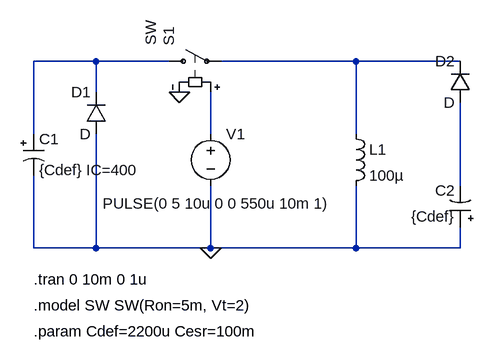
[diagram p0: schematic Coilgun-1V03.asc]
Coilgun-1V03.asc, the LTspice schematic file:
Version 4
SHEET 1 880 680
WIRE -672 -144 -768 -144
WIRE -560 -144 -672 -144
WIRE -272 -144 -480 -144
WIRE -112 -144 -272 -144
WIRE -672 -96 -672 -144
WIRE -768 -32 -768 -144
WIRE -496 -32 -496 -96
WIRE -272 -32 -272 -144
WIRE -112 48 -112 -80
WIRE -768 144 -768 32
WIRE -672 144 -672 -32
WIRE -672 144 -768 144
WIRE -496 144 -496 48
WIRE -496 144 -672 144
WIRE -272 144 -272 48
WIRE -272 144 -496 144
WIRE -112 144 -112 112
WIRE -112 144 -272 144
FLAG -496 144 0
FLAG -544 -96 0
SYMBOL polcap -784 -32 R0
WINDOW 3 24 56 Left 2
SYMATTR Value {Cdef} IC=400
SYMATTR InstName C1
SYMATTR SpiceLine V=63 Irms=900m Rser={Cesr} Lser=0
SYMATTR Description Capacitor
SYMATTR Type cap
SYMBOL ind -288 -48 R0
SYMATTR InstName L1
SYMATTR Value 100µ
SYMATTR SpiceLine Rser=133m
SYMBOL sw -576 -144 R270
WINDOW 3 24 -12 Left 2
WINDOW 38 24 -12 Left 2
SYMATTR Value ""
SYMATTR SpiceModel SW
SYMATTR InstName S1
SYMBOL voltage -496 -48 R0
WINDOW 3 -166 123 Left 2
WINDOW 123 0 0 Left 2
WINDOW 39 0 0 Left 2
SYMATTR Value PULSE(0 5 10u 0 0 550u 10m 1)
SYMATTR InstName V1
SYMBOL diode -96 -80 R180
WINDOW 0 24 64 Left 2
WINDOW 3 24 0 Left 2
SYMATTR InstName D2
SYMBOL diode -656 -32 R180
WINDOW 0 24 64 Left 2
WINDOW 3 24 0 Left 2
SYMATTR InstName D1
SYMBOL polcap -96 112 R180
WINDOW 3 24 17 Left 2
WINDOW 0 24 57 Left 2
SYMATTR Value {Cdef}
SYMATTR InstName C2
SYMATTR SpiceLine V=63 Irms=900m Rser={Cesr} Lser=0
SYMATTR Description Capacitor
SYMATTR Type cap
TEXT -768 192 Left 2 !.tran 0 10m 0 1u
TEXT -768 232 Left 2 !.model SW SW(Ron=5m, Vt=2)
TEXT -768 272 Left 2 !.param Cdef=2200u Cesr=100m

The netlist it stands for:
* Coilgun-1V03.asc
C1 N001 0 {Cdef} IC=400 V=63 Irms=900m Rser={Cesr} Lser=0
L1 N002 0 100µ Rser=133m
S1 N001 N002 N003 0 SW
V1 N003 0 PULSE(0 5 10u 0 0 550u 10m 1)
D2 N004 N002 D
D1 0 N001 D
C2 0 N004 {Cdef} V=63 Irms=900m Rser={Cesr} Lser=0
.model D D
.lib standard.dio
.tran 0 10m 0 1u
.model SW SW(Ron=5m, Vt=2)
.param Cdef=2200u Cesr=100m
.backanno
.end